# EAGLE design 5v AC DC reg (EAGLE 9.6.2)
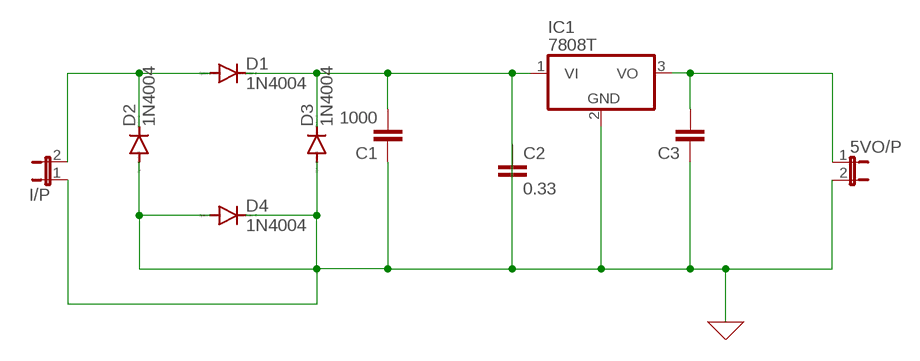
[diagram p0: schematic, sheet 1]

## Parts
5VO/P  JP1E  [JP1]
C1  1000  C2,5-3  [C2.5-3]
C2  0.33  C2,5-3  [C2.5-3]
C3  C2,5-3  [C2.5-3]
D1  1N4004  [DO41-10]
D2  1N4004  [DO41-10]
D3  1N4004  [DO41-10]
D4  1N4004  [DO41-10]
I/P  JP1E  [JP1]
IC1  7808T  [TO220H]

## Nets
0: 5VO/P.2 C1.1 C2.1 C3.1 D2.A D3.A D4.A D4.C I/P.1 IC1.2(GND) ; supply symbol labelled GND
N$1: D1.A D2.C I/P.2
N$2: C1.2 C2.2 D1.C D3.C IC1.1(VI)
N$7: 5VO/P.1 C3.2 IC1.3(VO)

## Library data of the parts
5VO/P I/P = jumper:JP1E: JUMPER
C1-C3 = capacitor-wima:C: CAPACITOR naming: grid - package width
D1-D4 = diode:1N4004: DIODE general purpose rectifier, 1 A
IC1 = linear:78*: Positive VOLTAGE REGULATOR Source: http://cache.national.com/ds/LM/LM78L05.pdf http://www.fairchildsemi.com/ds/LM/LM7805.pdf

## Board
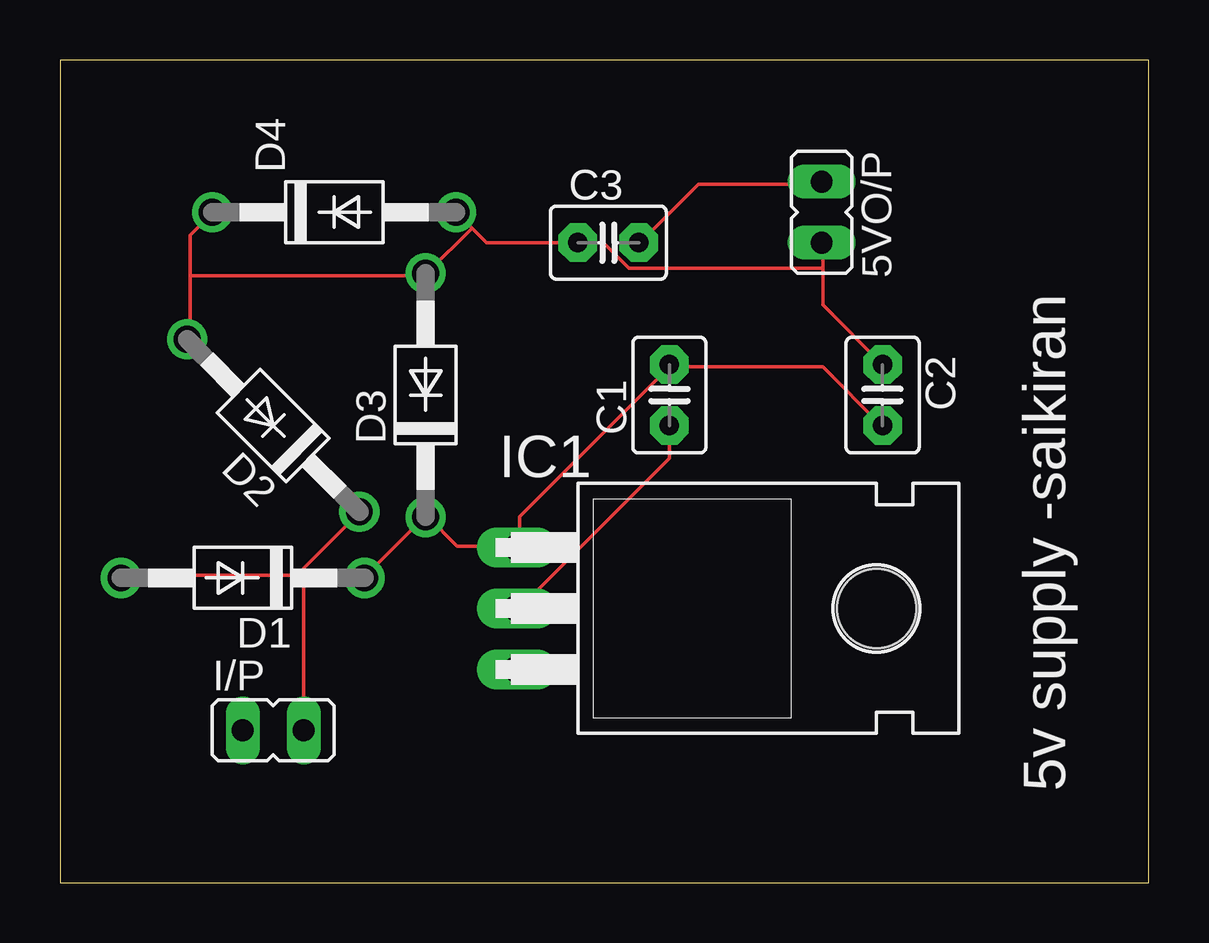
[diagram p1: board, top side]
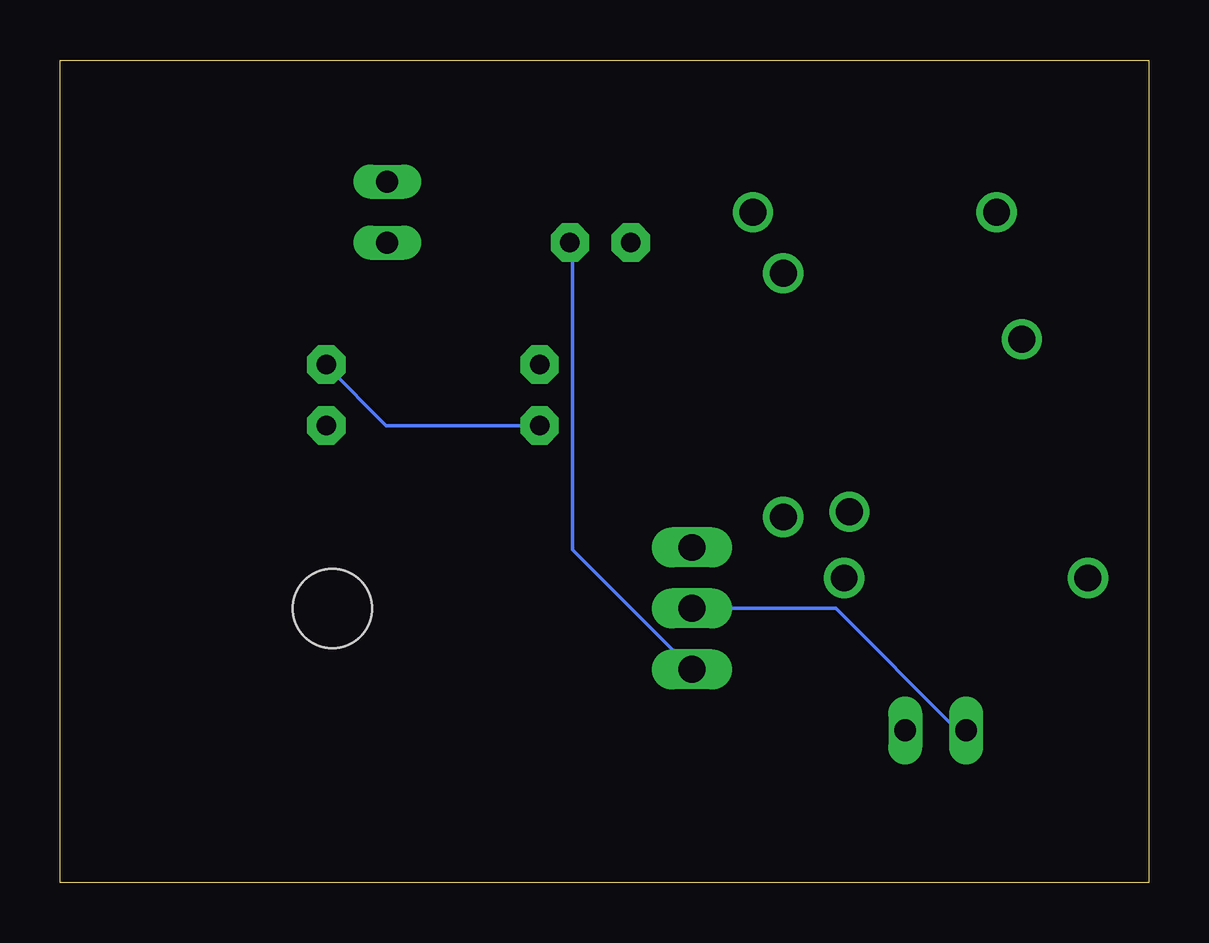
[diagram p2: board, bottom side, seen from below]

Size 45.39 x 34.28 mm. Coordinates in mm from the lower left corner, seen from the top.
Outline: 0,0 45.39,0 45.39,34.28 0,34.28 0,0
Copper layers (1*16): Top 0.035mm / dielectric 1.5mm / Bottom 0.035mm
Design rules "default": minimum track width 6mil, minimum drill 0.35mm, track to track 6mil, track to pad 6mil, pad to pad 6mil, via to via 6mil, smd to smd 6mil, copper to edge 40mil, drill to drill 6mil, minimum pad ring 10mil, minimum via ring 8mil, stop-mask expansion 4mil, vias tented up to drill 0mil, thermal gap 10mil

### Footprints (pad centres in the part's own frame; a part is rotated, then mirrored left to right if it is on the bottom)
JP1 = drill 0.914 long: 1 0,-1.27; 2 0,1.27
C2.5-3 = drill 0.813 pad 1.6 octagon: 1 -1.27,0; 2 1.27,0
DO41-10 = drill 1.118: A 5.08,0; C -5.08,0
TO220H = drill 1.118 long: 1 -2.54,-10.16; 2 0,-10.16; 3 2.54,-10.16 | hole 3.302: 0,4.826

### Placement (x,y rotation side)
5VO/P  31.75,27.94 180 top
C1  25.4,20.32 90 top
C2  34.29,20.32 270 top
C3  22.86,26.67 0 top
D1  7.62,12.7 180 top
D2  8.89,19.05 135 top
D3  15.24,20.32 90 top
D4  11.43,27.94 0 top
I/P  8.89,6.35 270 top
IC1  29.21,11.43 270 top

### Tracks (layer width: path | path; a pad name or v marks a point on that pad's centre or on a via)
0
  Top 0.152: 5.44,25.3 5.44,26.98 6.35,27.89 D4.C | 5.44,25.3 5.44,22.71 D2.A | D4.A 17.17,27.28 | 17.17,27.28 17.78,26.67 C3.1 22.66,26.67 23.72,25.6 31.8,25.6 | 17.17,27.28 15.34,25.45 D3.A 15.19,25.3 5.44,25.3 | 31.8,25.6 31.8,24.08 C2.1 | 31.8,25.6 31.8,26.67 5VO/P.2 | C1.1 25.4,17.68 19.15,11.43 IC1.2
  Bottom 0.152: IC1.2 13.06,11.43 8.03,6.4 7.72,6.4 I/P.1 | C1.1 31.8,19.05 34.24,21.49 C2.1
N$1
  Top 0.152: 10.16,12.8 10.16,13.11 12.45,15.39 D2.C | 10.16,12.8 I/P.2 | 10.16,12.8 2.54,12.8 D1.A
N$2
  Top 0.152: D1.C 12.75,12.8 15.19,15.24 D3.C 15.34,15.24 16.56,14.02 19,14.02 IC1.1 19.15,14.02 19.15,15.24 25.4,21.49 | 25.4,21.49 31.8,21.49 34.24,19.05 C2.2 | 25.4,21.49 C1.2
N$7
  Top 0.152: 5VO/P.1 31.65,29.11 26.62,29.11 24.18,26.67 C3.2
  Bottom 0.152: IC1.3 24.03,13.87 24.03,26.67 C3.2

### Text on the board
tPlace: 5v supply -saikiran